# EAGLE design LVDT-Sensor NeuRev01 (EAGLE 5.12)
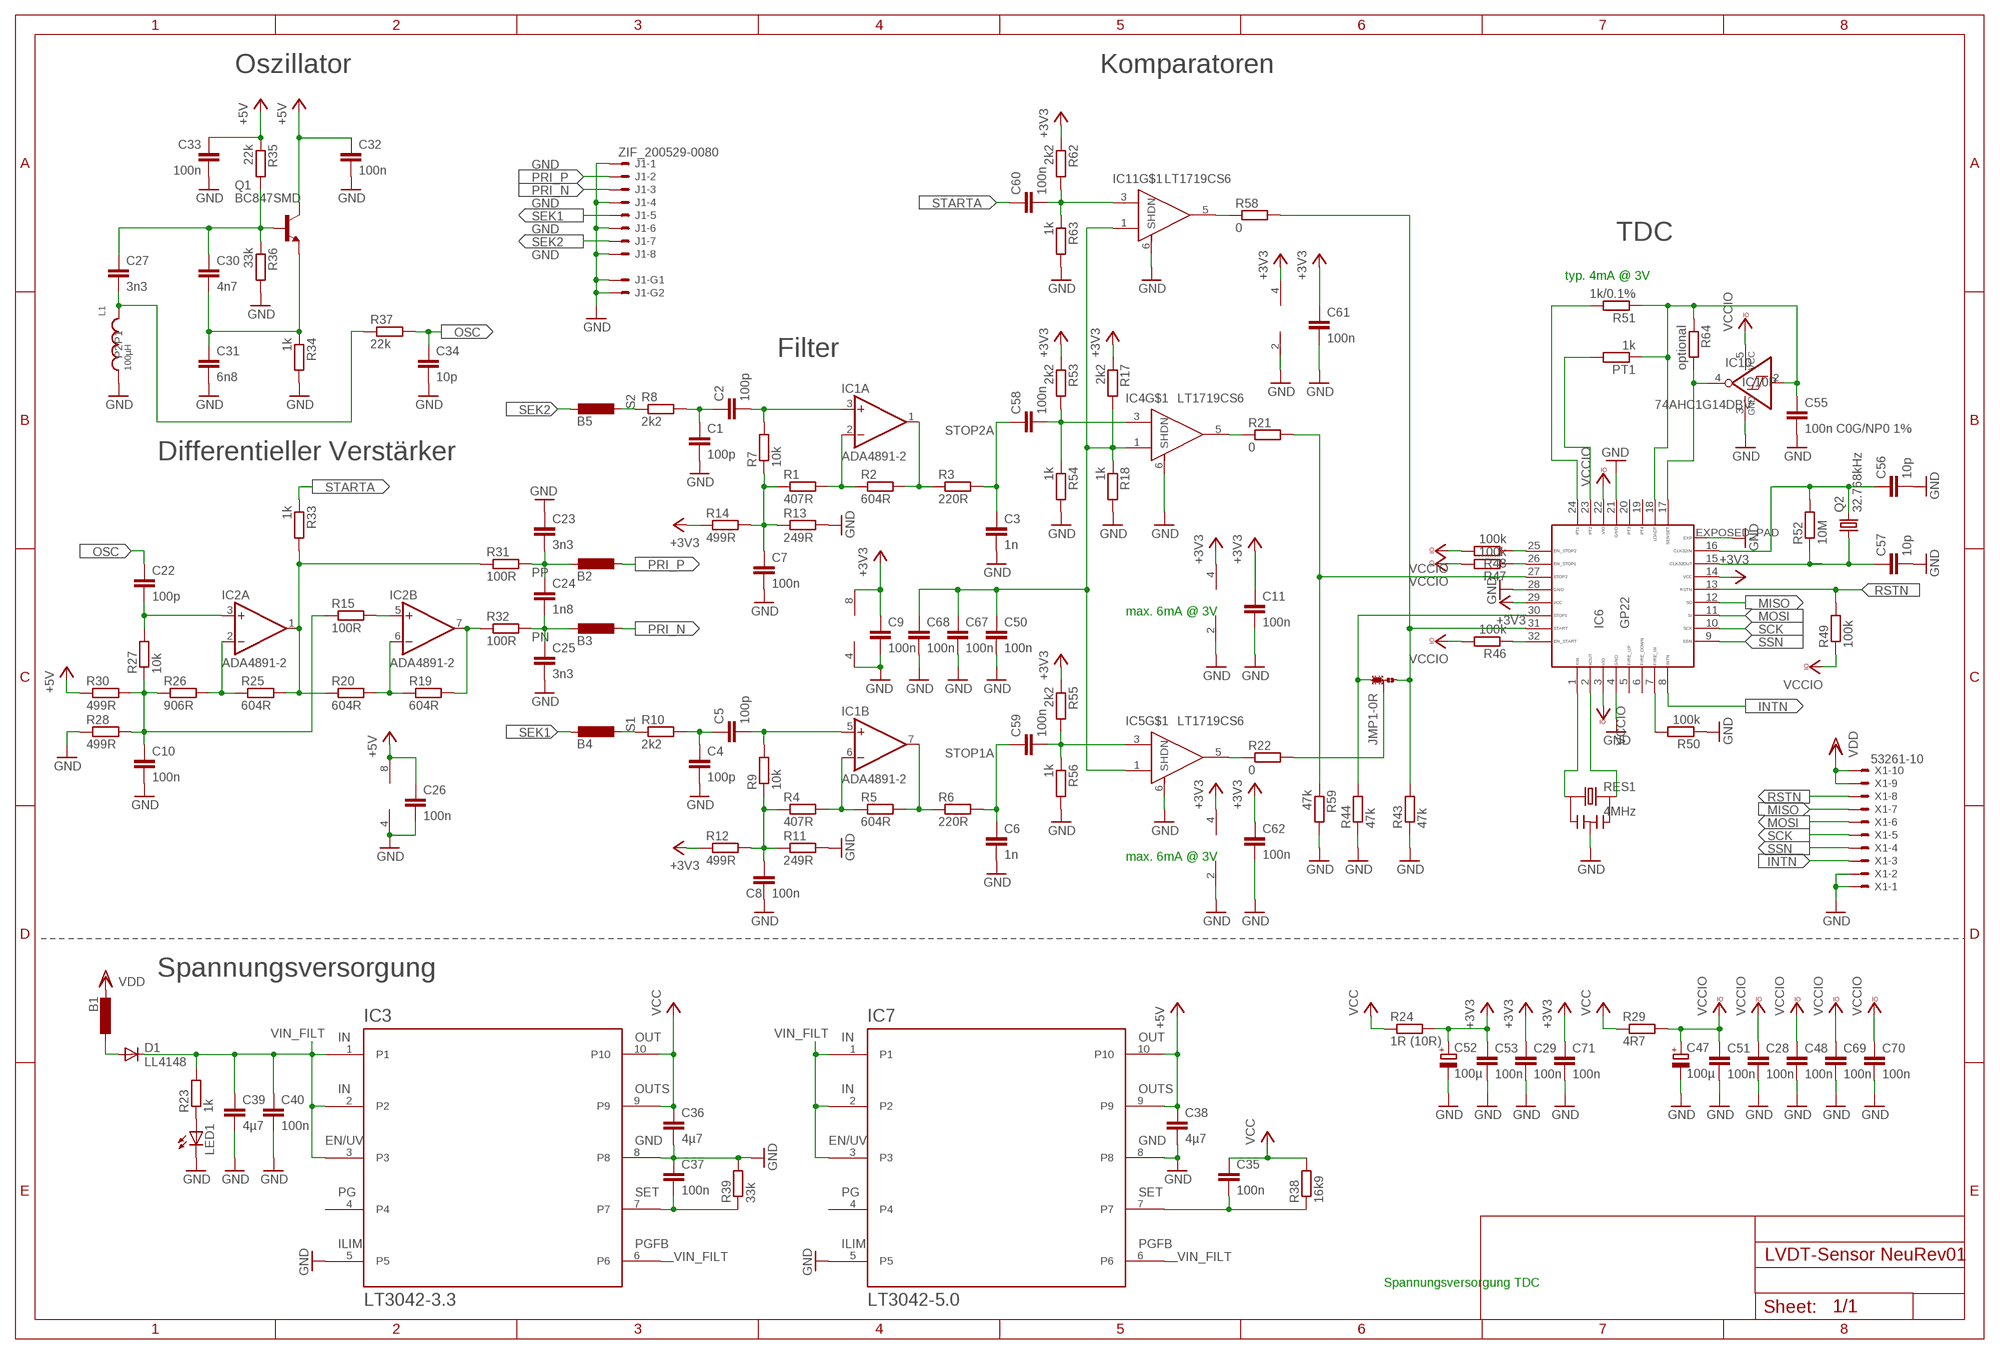
[diagram p0: schematic, sheet 1]

## Parts
B1  FERRITE-BEAD-SMD0805  [L0805]
B2  FERRITE-BEAD-SMD0805  [L0805]
B3  FERRITE-BEAD-SMD0805  [L0805]
B4  FERRITE-BEAD-SMD0805  [L0805]
B5  FERRITE-BEAD-SMD0805  [L0805]
C1  100p  C-EU0603-WAVE_SOLDERING  [0603-WAVE_SOLDERING]
C2  100p  C-EU0603-WAVE_SOLDERING  [0603-WAVE_SOLDERING]
C3  1n  C-EU0603-WAVE_SOLDERING  [0603-WAVE_SOLDERING]
C4  100p  C-EU0603-WAVE_SOLDERING  [0603-WAVE_SOLDERING]
C5  100p  C-EU0603-WAVE_SOLDERING  [0603-WAVE_SOLDERING]
C6  1n  C-EU0603-WAVE_SOLDERING  [0603-WAVE_SOLDERING]
C7  100n  C-EU0603-WAVE_SOLDERING  [0603-WAVE_SOLDERING]
C8  100n  C-EU0603-WAVE_SOLDERING  [0603-WAVE_SOLDERING]
C9  100n  C-EU0603-WAVE_SOLDERING  [0603-WAVE_SOLDERING]
C10  100n  C-EU0603-WAVE_SOLDERING  [0603-WAVE_SOLDERING]
C11  100n  C-EU0603-WAVE_SOLDERING  [0603-WAVE_SOLDERING]
C22  100p  C-EU0603-WAVE_SOLDERING  [0603-WAVE_SOLDERING]
C23  3n3  C-EU0603-WAVE_SOLDERING  [0603-WAVE_SOLDERING]
C24  1n8  C-EU0603-WAVE_SOLDERING  [0603-WAVE_SOLDERING]
C25  3n3  C-EU0603-WAVE_SOLDERING  [0603-WAVE_SOLDERING]
C26  100n  C-EU0603-WAVE_SOLDERING  [0603-WAVE_SOLDERING]
C27  3n3  C-EU0603-WAVE_SOLDERING  [0603-WAVE_SOLDERING]
C28  100n  C-EU0603-WAVE_SOLDERING  [0603-WAVE_SOLDERING]
C29  100n  C-EU0603-WAVE_SOLDERING  [0603-WAVE_SOLDERING]
C30  4n7  C-EU0603-WAVE_SOLDERING  [0603-WAVE_SOLDERING]
C31  6n8  C-EU0603-WAVE_SOLDERING  [0603-WAVE_SOLDERING]
C32  100n  C-EU0603-WAVE_SOLDERING  [0603-WAVE_SOLDERING]
C33  100n  C-EU0603-WAVE_SOLDERING  [0603-WAVE_SOLDERING]
C34  10p  C-EU0603-WAVE_SOLDERING  [0603-WAVE_SOLDERING]
C35  100n  C-EU0603-WAVE_SOLDERING  [0603-WAVE_SOLDERING]
C36  4µ7  C-EU1206-WAVE_SOLDERING  [1206-WAVE_SOLDERING]
C37  100n  C-EU0603-WAVE_SOLDERING  [0603-WAVE_SOLDERING]
C38  4µ7  C-EU1206-WAVE_SOLDERING  [1206-WAVE_SOLDERING]
C39  4µ7  C-EU1206-WAVE_SOLDERING  [1206-WAVE_SOLDERING]
C40  100n  C-EU0603-WAVE_SOLDERING  [0603-WAVE_SOLDERING]
C47  100µ  CPOL-EUSMCD  [SMC_D]
C48  100n  C-EU0603-WAVE_SOLDERING  [0603-WAVE_SOLDERING]
C50  100n  C-EU0603-WAVE_SOLDERING  [0603-WAVE_SOLDERING]
C51  100n  C-EU0603-WAVE_SOLDERING  [0603-WAVE_SOLDERING]
C52  100µ  CPOL-EUSMCD  [SMC_D]
C53  100n  C-EU0603-WAVE_SOLDERING  [0603-WAVE_SOLDERING]
C55  100n C0G/NP0 1%  C-EU1206-WAVE_SOLDERING  [1206-WAVE_SOLDERING]
C56  10p  C-EU0603-WAVE_SOLDERING  [0603-WAVE_SOLDERING]
C57  10p  C-EU0603-WAVE_SOLDERING  [0603-WAVE_SOLDERING]
C58  100n  C-EU0603-WAVE_SOLDERING  [0603-WAVE_SOLDERING]
C59  100n  C-EU0603-WAVE_SOLDERING  [0603-WAVE_SOLDERING]
C60  100n  C-EU0603-WAVE_SOLDERING  [0603-WAVE_SOLDERING]
C61  100n  C-EU0603-WAVE_SOLDERING  [0603-WAVE_SOLDERING]
C62  100n  C-EU0603-WAVE_SOLDERING  [0603-WAVE_SOLDERING]
C67  100n  C-EU0603-WAVE_SOLDERING  [0603-WAVE_SOLDERING]
C68  100n  C-EU0603-WAVE_SOLDERING  [0603-WAVE_SOLDERING]
C69  100n  C-EU0603-WAVE_SOLDERING  [0603-WAVE_SOLDERING]
C70  100n  C-EU0603-WAVE_SOLDERING  [0603-WAVE_SOLDERING]
C71  100n  C-EU0603-WAVE_SOLDERING  [0603-WAVE_SOLDERING]
D1  LL4148  DIODE-SOD80C  [SOD80C]
IC1  ADA4891-2  [MSOP8]
IC2  ADA4891-2  [MSOP8]
IC3  LT3042-3.3  REGLER_LT3042MSOP10_LT3042  [MSOP10]
IC4  LT1719CS6  [TSOT-23-6]
IC5  LT1719CS6  [TSOT-23-6]
IC6  GP22  [QFN32]
IC7  LT3042-5.0  REGLER_LT3042MSOP10_LT3042  [MSOP10]
IC10  74AHC1G14DBV  [SOT23-5]
IC11  LT1719CS6  [TSOT-23-6]
J1  ZIF_200529-0080  MOLEX_ZIF_8  [200529-0080]
JMP1  0R-JUMPA  [A0R-JMP]
L1  100µH  74408943101  [74408943101]
LED1  LEDCHIPLED_0603  [CHIPLED_0603]
PT1  1k  R-EU_0805-WAVE_SOLDERING  [0805-WAVE_SOLDERING]
Q1  BC847SMD  [SOT23]
Q2  32.768kHz  CRYSTALCC7V  [CC7V]
R1  407R  R-EU_0603-WAVE_SOLDERING  [0603-WAVE_SOLDERING]
R2  604R  R-EU_0603-WAVE_SOLDERING  [0603-WAVE_SOLDERING]
R3  220R  R-EU_0603-WAVE_SOLDERING  [0603-WAVE_SOLDERING]
R4  407R  R-EU_0603-WAVE_SOLDERING  [0603-WAVE_SOLDERING]
R5  604R  R-EU_0603-WAVE_SOLDERING  [0603-WAVE_SOLDERING]
R6  220R  R-EU_0603-WAVE_SOLDERING  [0603-WAVE_SOLDERING]
R7  10k  R-EU_0603-WAVE_SOLDERING  [0603-WAVE_SOLDERING]
R8  2k2  R-EU_0603-WAVE_SOLDERING  [0603-WAVE_SOLDERING]
R9  10k  R-EU_0603-WAVE_SOLDERING  [0603-WAVE_SOLDERING]
R10  2k2  R-EU_0603-WAVE_SOLDERING  [0603-WAVE_SOLDERING]
R11  249R  R-EU_0603-WAVE_SOLDERING  [0603-WAVE_SOLDERING]
R12  499R  R-EU_0603-WAVE_SOLDERING  [0603-WAVE_SOLDERING]
R13  249R  R-EU_0603-WAVE_SOLDERING  [0603-WAVE_SOLDERING]
R14  499R  R-EU_0603-WAVE_SOLDERING  [0603-WAVE_SOLDERING]
R15  100R  R-EU_0603-WAVE_SOLDERING  [0603-WAVE_SOLDERING]
R17  2k2  R-EU_0603-WAVE_SOLDERING  [0603-WAVE_SOLDERING]
R18  1k  R-EU_0603-WAVE_SOLDERING  [0603-WAVE_SOLDERING]
R19  604R  R-EU_0603-WAVE_SOLDERING  [0603-WAVE_SOLDERING]
R20  604R  R-EU_0603-WAVE_SOLDERING  [0603-WAVE_SOLDERING]
R21  0  R-EU_0603-WAVE_SOLDERING  [0603-WAVE_SOLDERING]
R22  0  R-EU_0603-WAVE_SOLDERING  [0603-WAVE_SOLDERING]
R23  1k  R-EU_0603-WAVE_SOLDERING  [0603-WAVE_SOLDERING]
R24  1R (10R)  R-EU_0805-WAVE_SOLDERING  [0805-WAVE_SOLDERING]
R25  604R  R-EU_0603-WAVE_SOLDERING  [0603-WAVE_SOLDERING]
R26  906R  R-EU_0603-WAVE_SOLDERING  [0603-WAVE_SOLDERING]
R27  10k  R-EU_0603-WAVE_SOLDERING  [0603-WAVE_SOLDERING]
R28  499R  R-EU_0603-WAVE_SOLDERING  [0603-WAVE_SOLDERING]
R29  4R7  R-EU_0805-WAVE_SOLDERING  [0805-WAVE_SOLDERING]
R30  499R  R-EU_0603-WAVE_SOLDERING  [0603-WAVE_SOLDERING]
R31  100R  R-EU_0603-WAVE_SOLDERING  [0603-WAVE_SOLDERING]
R32  100R  R-EU_0603-WAVE_SOLDERING  [0603-WAVE_SOLDERING]
R33  1k  R-EU_0603-WAVE_SOLDERING  [0603-WAVE_SOLDERING]
R34  1k  R-EU_0603-WAVE_SOLDERING  [0603-WAVE_SOLDERING]
R35  22k  R-EU_0603-WAVE_SOLDERING  [0603-WAVE_SOLDERING]
R36  33k  R-EU_0603-WAVE_SOLDERING  [0603-WAVE_SOLDERING]
R37  22k  R-EU_0603-WAVE_SOLDERING  [0603-WAVE_SOLDERING]
R38  16k9  R-EU_0603-WAVE_SOLDERING  [0603-WAVE_SOLDERING]
R39  33k  R-EU_0603-WAVE_SOLDERING  [0603-WAVE_SOLDERING]
R43  47k  R-EU_0603-WAVE_SOLDERING  [0603-WAVE_SOLDERING]
R44  47k  R-EU_0603-WAVE_SOLDERING  [0603-WAVE_SOLDERING]
R46  100k  R-EU_0603-WAVE_SOLDERING  [0603-WAVE_SOLDERING]
R47  100k  R-EU_0603-WAVE_SOLDERING  [0603-WAVE_SOLDERING]
R48  100k  R-EU_0603-WAVE_SOLDERING  [0603-WAVE_SOLDERING]
R49  100k  R-EU_0603-WAVE_SOLDERING  [0603-WAVE_SOLDERING]
R50  100k  R-EU_0603-WAVE_SOLDERING  [0603-WAVE_SOLDERING]
R51  1k/0.1%  R-EU_0805-WAVE_SOLDERING  [0805-WAVE_SOLDERING]
R52  10M  R-EU_0603-WAVE_SOLDERING  [0603-WAVE_SOLDERING]
R53  2k2  R-EU_0603-WAVE_SOLDERING  [0603-WAVE_SOLDERING]
R54  1k  R-EU_0603-WAVE_SOLDERING  [0603-WAVE_SOLDERING]
R55  2k2  R-EU_0603-WAVE_SOLDERING  [0603-WAVE_SOLDERING]
R56  1k  R-EU_0603-WAVE_SOLDERING  [0603-WAVE_SOLDERING]
R58  0  R-EU_0603-WAVE_SOLDERING  [0603-WAVE_SOLDERING]
R59  47k  R-EU_0603-WAVE_SOLDERING  [0603-WAVE_SOLDERING]
R62  2k2  R-EU_0603-WAVE_SOLDERING  [0603-WAVE_SOLDERING]
R63  1k  R-EU_0603-WAVE_SOLDERING  [0603-WAVE_SOLDERING]
R64  optional  R-EU_0603-WAVE_SOLDERING  [0603-WAVE_SOLDERING]
RES1  4MHz  CSTCRG53-R0  [CSTCR]
X1  53261-10  [53261-10]

## Nets
+3V3: C9.1 C11.1 C29.1 C52.+ C53.1 C61.1 C62.1 C71.1 IC1.8(V+) IC4.4(VCC) IC5.4(VCC) IC6.14(VCC) IC6.29(VCC) IC11.4(VCC) R12.1 R14.1 R17.1 R24.2 R53.1 R55.1 R62.1
+5V: C26.1 C32.1 C33.1 C38.1 IC2.8(V+) IC7.9 IC7.10 Q1.3(C) R30.1 R35.1
GND: C1.2 C3.2 C4.2 C6.2 C7.2 C8.2 C9.2 C10.2 C11.2 C23.1 C25.2 C26.2 C28.2 C29.2 C31.2 C32.2 C33.2 C34.2 C36.2 C37.1 C38.2 C39.2 C40.2 C47.- C48.2 C50.2 C51.2 C52.- C53.2 C55.2 C56.2 C57.2 C61.2 C62.2 C67.2 C68.2 C69.2 C70.2 C71.2 IC1.4(V-) IC2.4(V-) IC3.5 IC3.8 IC4.2(VDD) IC4.6(SHDN) IC5.2(VDD) IC5.6(SHDN) IC6.4(GND) IC6.21(GND) IC6.28(GND) IC6.EXPOSED_PAD(EXP) IC7.5 IC7.8 IC10.3(GND) IC11.2(VDD) IC11.6(SHDN) J1.1 J1.4 J1.6 J1.8 J1.G1 J1.G2 L1.P2 LED1.C R11.2 R13.2 R18.2 R28.1 R34.2 R36.2 R39.2 R43.1 R44.1 R50.1 R54.2 R56.2 R59.2 R63.2 RES1.2 X1.1 X1.2
INTN: IC6.8(INTN) X1.3
MISO: IC6.12(SO) X1.7
MOSI: IC6.11(SI) X1.6
N$1: IC1.7(B:OUT) R5.2 R6.1
N$2: JMP1.2 R22.2
N$3: IC1.6(B:-IN) R4.2 R5.1
N$4: IC1.2(A:-IN) R1.2 R2.1
N$5: IC1.1(A:OUT) R2.2 R3.1
N$6: C5.2 IC1.5(B:+IN) R9.2
N$7: LED1.A R23.1
N$8: B1.1 D1.A
N$9: C50.1 C67.1 C68.1 IC4.1(-IN) IC5.1(-IN) IC11.1(-IN) R17.2 R18.1
N$10: IC2.5(B:+IN) R15.2
N$11: C8.1 R4.1 R9.1 R11.1 R12.2
N$12: C7.1 R1.1 R7.1 R13.1 R14.2
N$13: C2.2 IC1.3(A:+IN) R7.2
N$14: C4.1 C5.1 R10.2
N$15: C1.1 C2.1 R8.2
N$16: IC2.1(A:OUT) R20.1 R25.2 R31.1 R33.2
N$17: C10.1 R15.1 R26.1 R27.1 R28.2 R30.2
N$18: IC2.6(B:-IN) R19.1 R20.2
N$20: IC2.7(B:OUT) R19.2 R32.1
N$21: IC2.2(A:-IN) R25.1 R26.2
N$23: IC5.5(OUT) R22.1
N$24: IC4.5(OUT) R21.1
N$25: C27.2 L1.P1 R37.1
N$27: IC6.32(EN_START) R46.1
N$28: C37.2 IC3.7 R39.1
N$29: C30.2 C31.1 Q1.2(E) R34.1
N$30: IC6.2(XOUT) RES1.3
N$31: IC6.1(XIN) RES1.1
N$32: C22.2 IC2.3(A:+IN) R27.2
N$33: IC6.26(EN_STOP1) R47.1
N$34: IC6.25(EN_STOP2) R48.1
N$35: IC6.7(FIRE_IN) R50.2
N$36: C55.1 IC6.18(LOADT) IC10.2(I) PT1.1 R51.1 R64.1
N$38: C35.2 IC7.7 R38.1
N$39: IC6.23(PT2) PT1.2
N$40: C27.1 C30.1 Q1.1(B) R35.2 R36.1
N$49: IC6.24(PT1) R51.2
N$56: IC11.5(OUT) R58.1
N$57: C56.1 IC6.16(CLK32IN) Q2.2 R52.2
N$60: C57.1 IC6.15(CLK32OUT) Q2.1 R52.1
N$61: C58.2 IC4.3(+IN) R53.2 R54.1
N$62: C59.2 IC5.3(+IN) R55.2 R56.1
N$63: C60.2 IC11.3(+IN) R62.2 R63.1
N$64: IC6.17(SENSET) IC10.4(O) R64.2
OSC: C22.1 C34.1 R37.2
PN: B3.2 C24.2 C25.1 R32.2
PP: B2.2 C23.2 C24.1 R31.2
PRI_N: B3.1 J1.3
PRI_P: B2.1 J1.2
RSTN: IC6.13(RSTN) R49.2 X1.8
S1: B4.1 R10.1
S2: B5.1 R8.1
SCK: IC6.10(SCK) X1.5
SEK1: B4.2 J1.5
SEK2: B5.2 J1.7
SSN: IC6.9(SSN) X1.4
START: IC6.31(START) JMP1.3 R43.2 R58.2
STARTA: C60.1 R33.1
STOP1: IC6.30(STOP1) JMP1.1 R44.2
STOP1A: C6.1 C59.1 R6.2
STOP2: IC6.27(STOP2) R21.2 R59.1
STOP2A: C3.1 C58.1 R3.2
VCC: C35.1 C36.1 IC3.9 IC3.10 R24.1 R29.1 R38.2
VCCIO: C28.1 C47.+ C48.1 C51.1 C69.1 C70.1 IC6.3(VIO) IC6.22(VIO) IC10.5(VCC) R29.2 R46.2 R47.2 R48.2 R49.1
VDD: B1.2 X1.9 X1.10
VIN_FILT: C39.1 C40.1 D1.C IC3.1 IC3.2 IC3.3 IC3.6 IC7.1 IC7.2 IC7.3 IC7.6 R23.2
Unconnected: IC3.4 IC6.5(FIRE_UP) IC6.6(FIRE_DOWN) IC6.19(PT4) IC6.20(PT3) IC7.4

## Notes on the sheet
- Oszillator | Komparatoren
- TDC
- typ. 4mA @ 3V
- Filter
- Differentieller Verstärker
- max. 6mA @ 3V
- max. 6mA @ 3V
- Spannungsversorgung
- Spannungsversorgung TDC

## Library data of the parts
B1-B5 = rcl:FERRITE-BEAD-SMD
C1-C11 C22-C40 C48 C50 C51 C53 C55-C62 C67-C71 = rcl:C-EU: CAPACITOR, European symbol
C47 C52 = rcl:CPOL-EU: POLARIZED CAPACITOR, European symbol
D1 = diode:DIODE-: DIODE
IC1 IC2 = LM7332:ADA4891-2
IC3 IC7 = Regler_LT3042:REGLER_LT3042
IC4 IC5 IC11 = linear-technology:LT1719: 4.5ns, Single/Dual Supply 3V/5V Comparators with Rail-to-Rail Outputs Linear Technology
IC6 = ACAM:GP22: Universal 2-Channel Time-to-Digital Converter
IC10 = 74xx-little-de:74*1G14: Single Schmitt-Trigger Inverter Gate
J1 = CON_FFC_FPC:MOLEX_ZIF_8: FFC-FPC ZIF Connector Bottom Contacts 8 Positions 1mm Pitch For FFC with thickness 0.3mm +- 0.05
JMP1 = jump-0r-smd:0R-JUMP: SMD 0R 0805 Jumper
L1 = WE-SPS SMD Schielded Power Inductor:74408943101: WE-SPS SMD Schielded Power Inductor
LED1 = led:LED: LED OSRAM: - CHIPLED LG R971, LG N971, LY N971, LG Q971, LY Q971, LO R971, LY R971 LH N974, LH R974 LS Q976, LO Q976, LY Q976 LO Q996 - Hyper CHIPLED LW Q18S LB Q993, LB Q99A, LB R99A - SideLED LS A670, LO A670, LY A670, LG A670, LP A670 LB A673, LV A673, LT A673, LW A673 LH A674 LY A675 LS A676, LA A676, LO A676, LY A676, LW A676 LS A679, LY A679, LG A679 - Hyper Micro SIDELED® LS Y876, LA Y876, LO Y876, LY Y876 LT Y87S - SmartLED LW L88C, LW L88S LB L89C, LB L89S, LG L890 LS L89K, LO L89K, LY L89K LS L896, LA L896, LO L896, LY L896 - TOPLED LS T670, LO T670, LY T670, LG T670, LP T670 LSG T670, LSP T670, LSY T670, LOP T670, LYG T670 LG T671, LOG T671, LSG T671 LB T673, LV T673, LT T673, LW T673 LH T674 LS T676, LA T676, LO T676, LY T676, LB T676, LH T676, LSB T676, LW T676 LB T67C, LV T67C, LT T67C, LS T67K, LO T67K, LY T67K, LW E67C LS E67B, LA E67B, LO E67B, LY E67B, LB E67C, LV E67C, LT E67C LW T67C LS T679, LY T679, LG T679 LS T770, LO T770, LY T770, LG T770, LP T770 LB T773, LV T773, LT T773, LW T773 LH T774 LS E675, LA E675, LY E675, LS T675 LS T776, LA T776, LO T776, LY T776, LB T776 LHGB T686 LT T68C, LB T68C - Hyper Mini TOPLED® LB M676 - Mini TOPLED Santana® LG M470 LS M47K, LO M47K, LY M47K Source: http://www.osram.convergy.de LUXEON: - LUMILED® LXK2-PW12-R00, LXK2-PW12-S00, LXK2-PW14-U00, LXK2-PW14-V00 LXK2-PM12-R00, LXK2-PM12-S00, LXK2-PM14-U00 LXK2-PE12-Q00, LXK2-PE12-R00, LXK2-PE12-S00, LXK2-PE14-T00, LXK2-PE14-U00 LXK2-PB12-K00, LXK2-PB12-L00, LXK2-PB12-M00, LXK2-PB14-N00, LXK2-PB14-P00, LXK2-PB14-Q00 LXK2-PR12-L00, LXK2-PR12-M00, LXK2-PR14-Q00, LXK2-PR14-R00 LXK2-PD12-Q00, LXK2-PD12-R00, LXK2-PD12-S00 LXK2-PH12-R00, LXK2-PH12-S00 LXK2-PL12-P00, LXK2-PL12-Q00, LXK2-PL12-R00 Source: www.luxeon.com KINGBRIGHT: KA-3528ASYC Source: www.kingbright.com
PT1 R1-R15 R17-R39 R43 R44 R46-R56 R58 R59 R62-R64 = rcl:R-EU_: RESISTOR, European symbol
Q1 = transistor-npn:BC847*: NPN Transistor
Q2 = crystal:CRYSTAL: CRYSTAL
RES1 = CeramicResonator:CSTCR: Murata CERALOCK
X1 = con-molex:53?-10: CONNECTOR wire to board 1.25 mm (.049 inch) pitch header; OC_FARNELL: unknown; OC_NEWARK: unknown

## Board
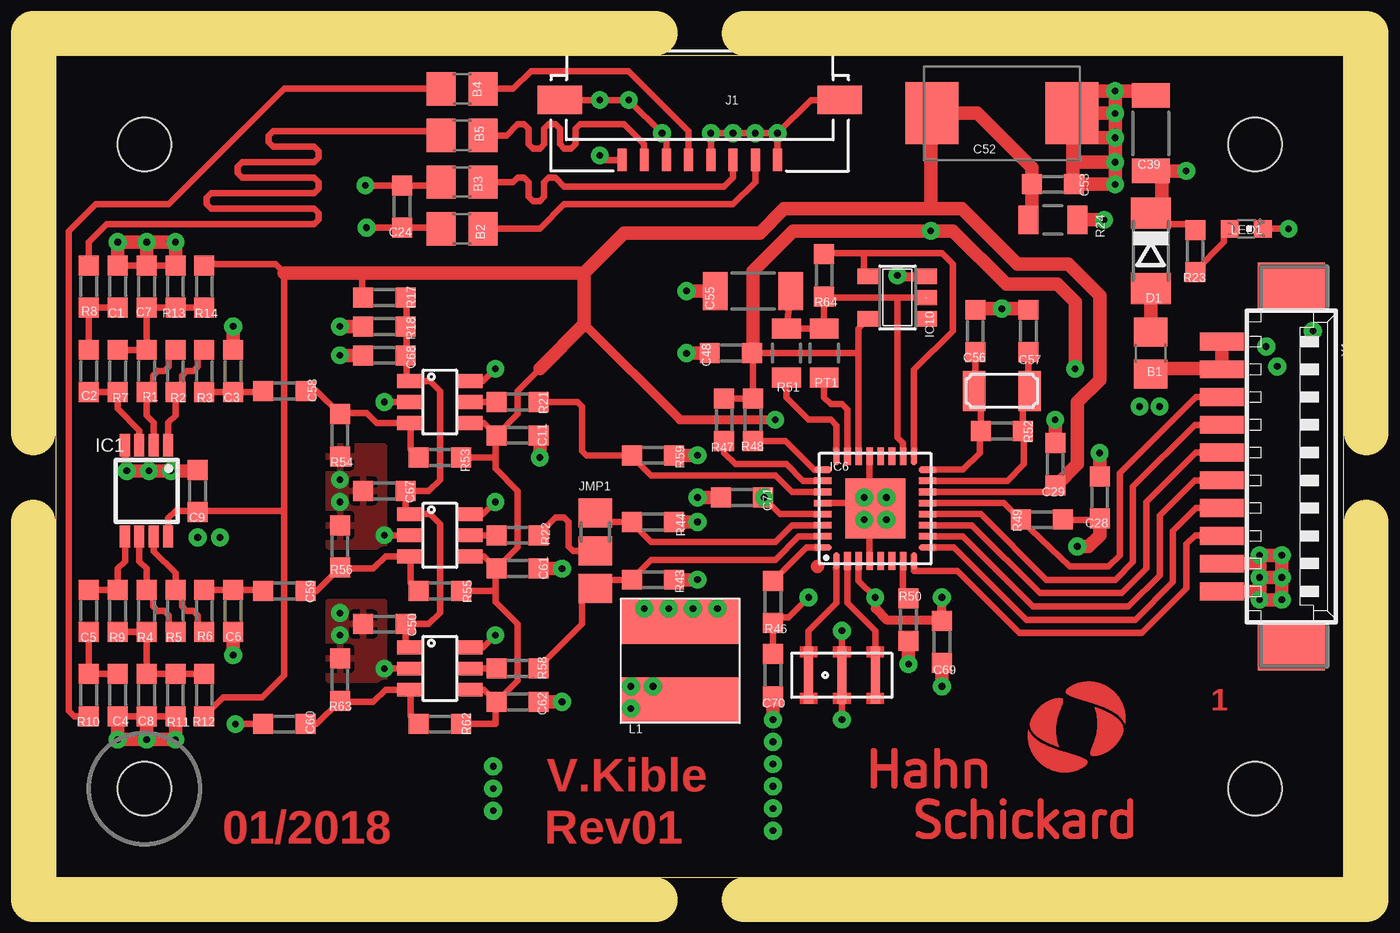
[diagram p1: board, top side]
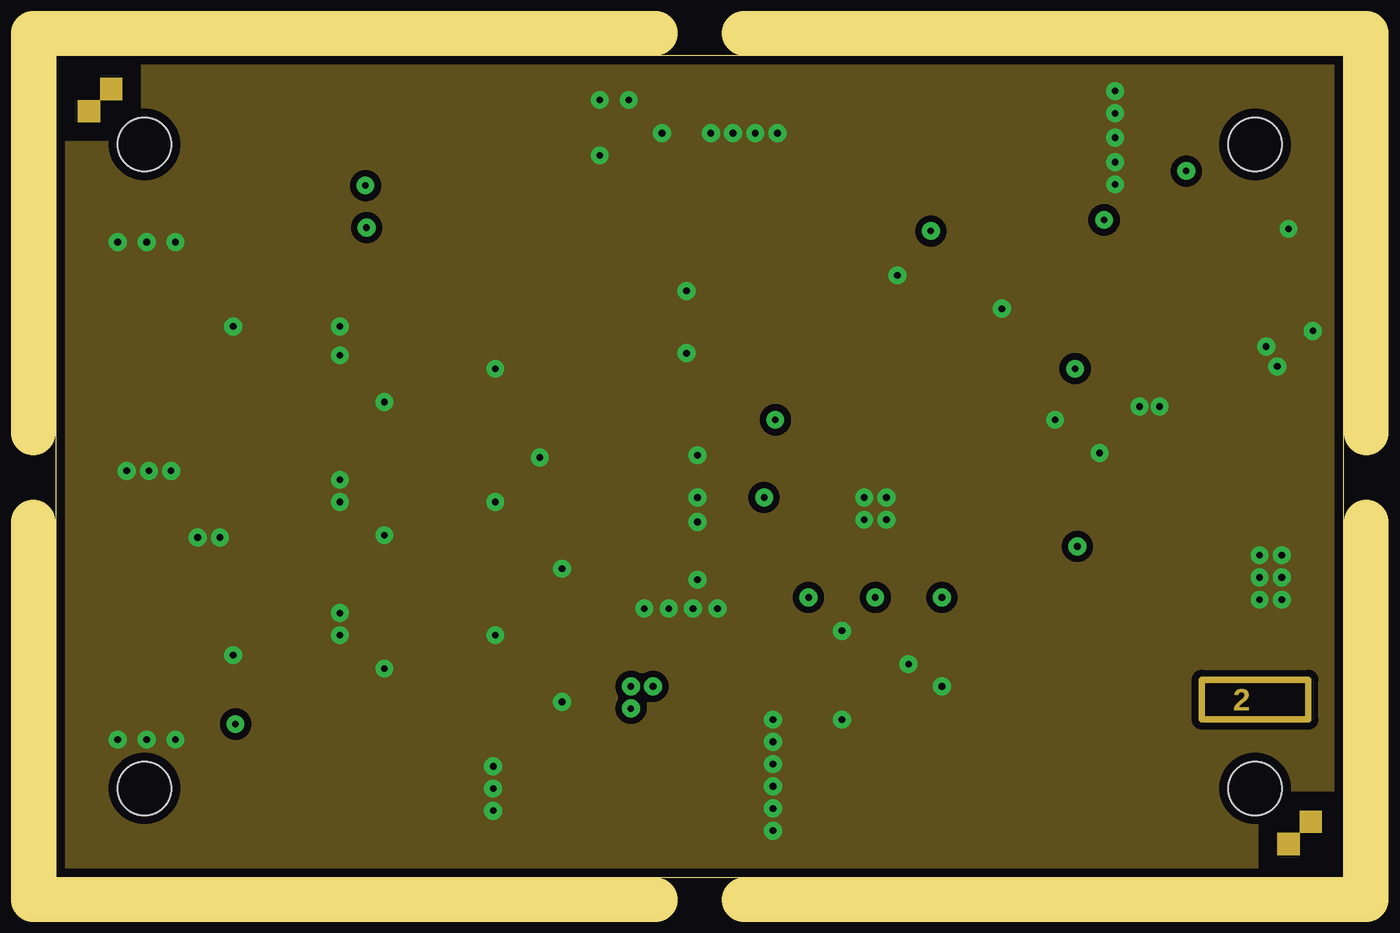
[diagram p2: board, inner layer Route2]
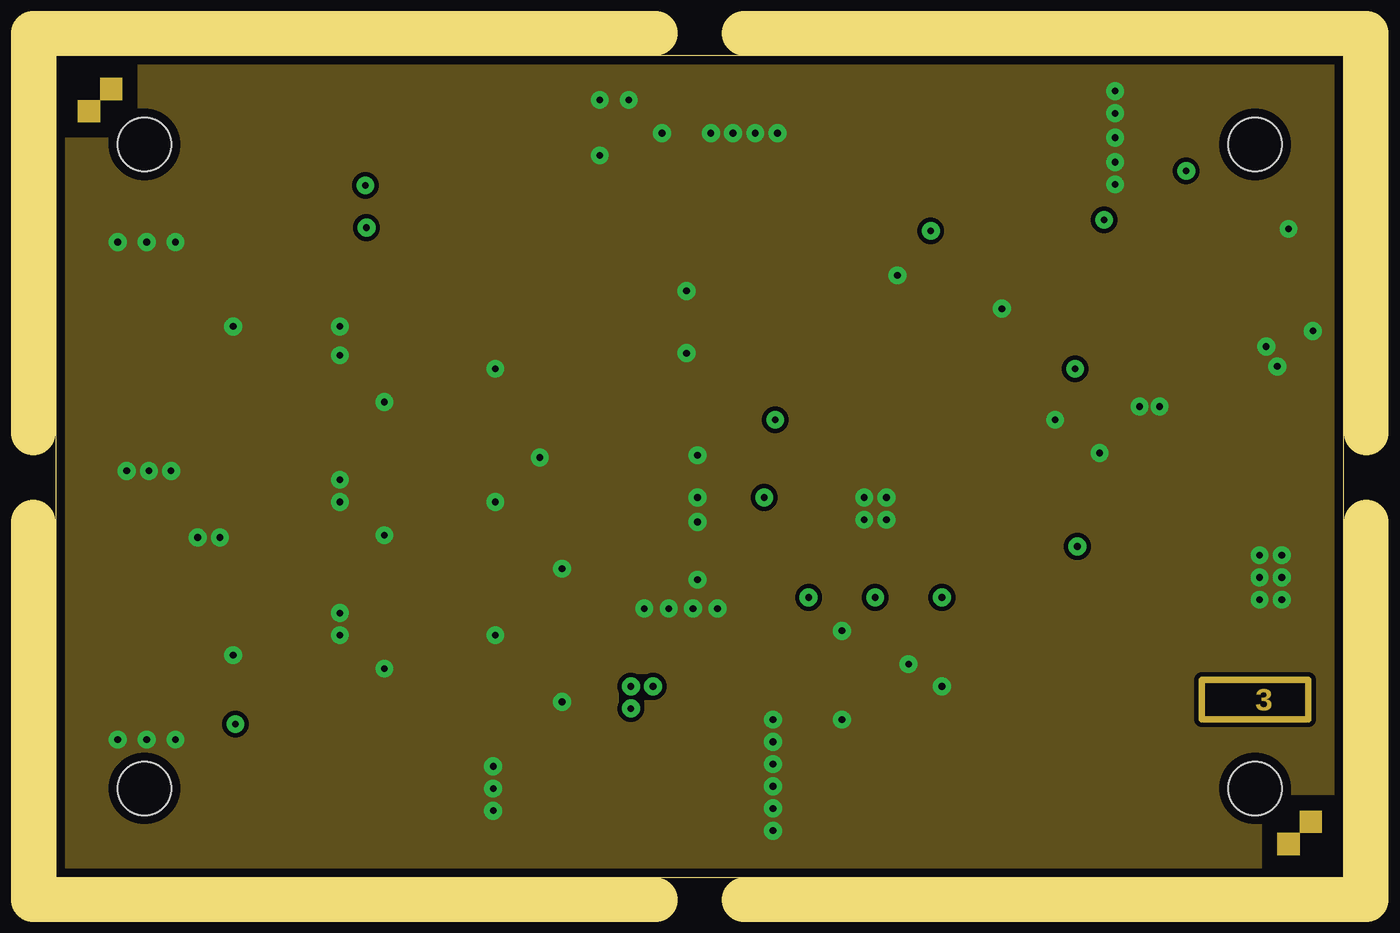
[diagram p3: board, inner layer Route15]
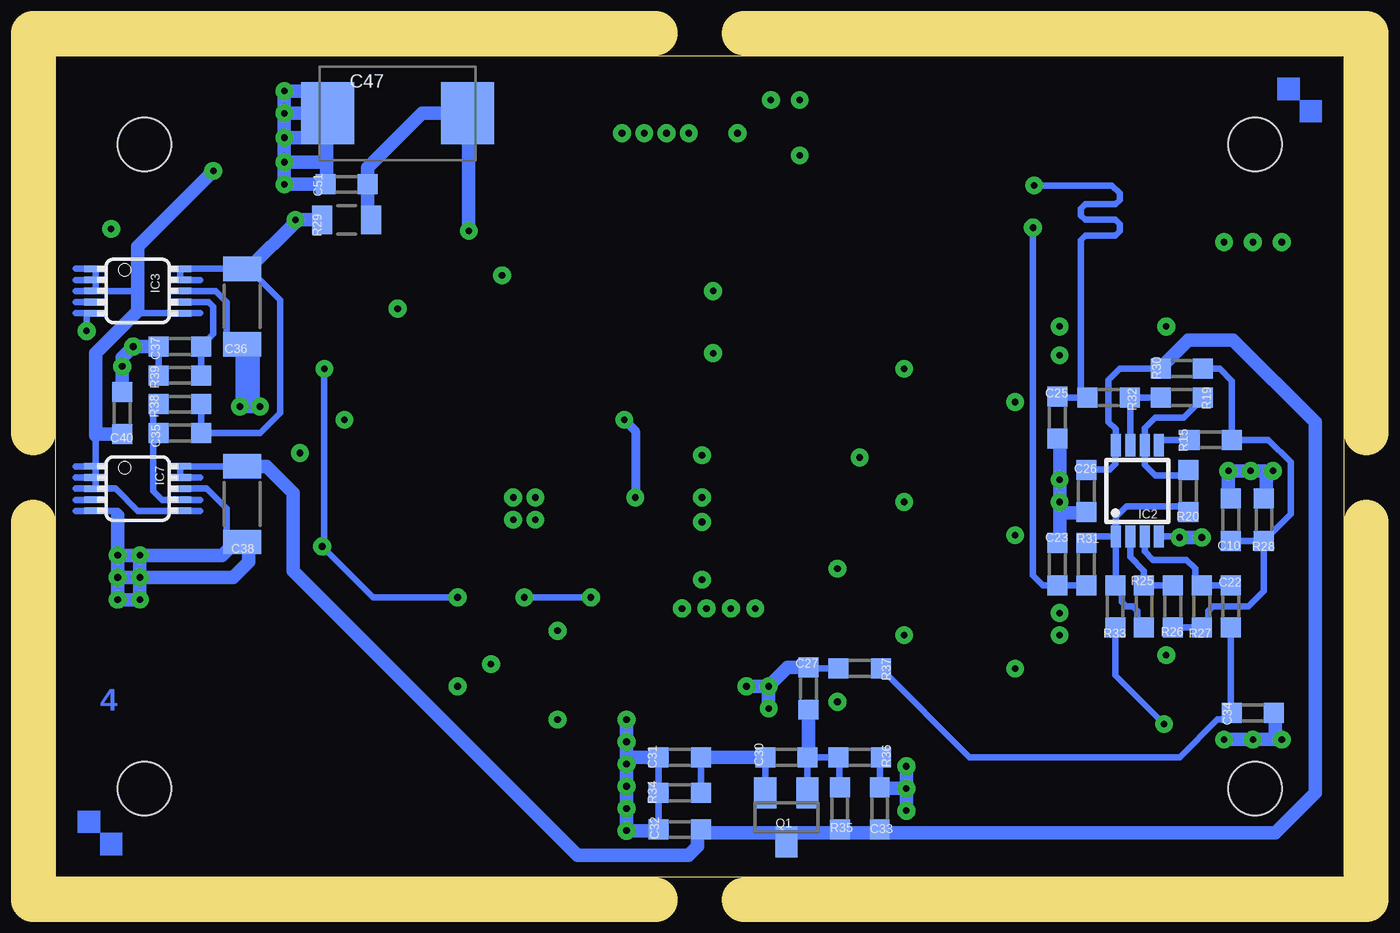
[diagram p4: board, bottom side, seen from below]

Size 58 x 37 mm. Coordinates in mm from the lower left corner, seen from the top.
Outline: 58,37 0,37 0,0 58,0 58,37
Copper layers (1*2+15*16): Top 0.035mm / dielectric 0.6mm / Route2 0.035mm / dielectric 0.2mm / Route15 0.035mm / dielectric 0.6mm / Bottom 0.035mm
Design rules "pcb-devboards Standard *": minimum track width 0.2mm, minimum drill 0.3mm, track to track 0.2mm, track to pad 0.2mm, pad to pad 0.2mm, via to via 0.2mm, smd to smd 0.2mm, copper to edge 0.4mm, drill to drill 0.2mm, minimum pad ring 0.25mm, minimum via ring 0.25mm, stop-mask expansion 0.1mm, vias tented up to drill 0.8mm, thermal gap 0.2mm
Holes 2.4 mm at 54,4 54,33 4,33 4,4
tRestrict: area 51.5,30.5 to 56.5,35.5; area 1.5,30.5 to 6.5,35.5; area 51.5,1.5 to 56.5,6.5
bRestrict: area 1.5,30.5 to 6.5,35.5; area 51.5,30.5 to 56.5,35.5; area 51.5,1.5 to 56.5,6.5
Milling: 8 lines

### Footprints (pad centres in the part's own frame; a part is rotated, then mirrored left to right if it is on the bottom)
L0805 = smd 1.3 x 1.5: 1 -0.95,0; 2 0.95,0
0603-WAVE_SOLDERING = smd 0.9 x 0.9: 1 -0.95,0; 2 0.95,0
1206-WAVE_SOLDERING = smd 1.1 x 1.7: 1 -1.7,0; 2 1.7,0
SMC_D = smd 2.4 x 2.8: + -3.15,0; - 3.15,0
SOD80C = smd 1.4 x 1.8: A 1.7,0; C -1.7,0
MSOP8 = smd 0.45 x 1: 1 -0.975,-2.05; 2 -0.325,-2.05; 3 0.325,-2.05; 4 0.975,-2.05; 5 0.975,2.05; 6 0.325,2.05; 7 -0.325,2.05; 8 -0.975,2.05
MSOP10 = smd 0.3 x 1.02: 1 -1,-1.9; 2 -0.5,-1.9; 3 0,-1.9; 4 0.5,-1.9; 5 1,-1.9; 6 1,1.9; 7 0.5,1.9; 8 0,1.9; 9 -0.5,1.9; 10 -1,1.9
TSOT-23-6 = smd 0.62 x 1.22: 1 -0.95,-1.31; 2 0,-1.31; 3 0.95,-1.31; 4 0.95,1.31; 5 0,1.31; 6 -0.95,1.31
QFN32 = smd 0.3 x 0.8: 1 -1.75,-2.36; 2 -1.25,-2.36; 3 -0.75,-2.36; 4 -0.25,-2.36; 5 0.25,-2.36; 6 0.75,-2.36; 7 1.25,-2.36; 8 1.75,-2.36; 17 1.75,2.36; 18 1.25,2.36; 19 0.75,2.36; 20 0.25,2.36; 21 -0.25,2.36; 22 -0.75,2.36; 23 -1.25,2.36; 24 -1.75,2.36 | smd 0.8 x 0.3: 9 2.36,-1.75; 10 2.36,-1.25; 11 2.36,-0.75; 12 2.36,-0.25; 13 2.36,0.25; 14 2.36,0.75; 15 2.36,1.25; 16 2.36,1.75; 25 -2.36,1.75; 26 -2.36,1.25; 27 -2.36,0.75; 28 -2.36,0.25; 29 -2.36,-0.25; 30 -2.36,-0.75; 31 -2.36,-1.25; 32 -2.36,-1.75 | smd 2.7 x 2.7: EXPOSED_PAD 0,0
SOT23-5 = smd 0.69 x 0.99: 1 -0.95,-1.29; 2 0,-1.29; 3 0.95,-1.29; 4 0.95,1.3; 5 -0.95,1.3
200529-0080 = smd 0.4 x 1: 1 -3.5,2.7; 2 -2.5,2.7; 3 -1.5,2.7; 4 -0.5,2.7; 5 0.5,2.7; 6 1.5,2.7; 7 2.5,2.7; 8 3.5,2.7 | smd 2 x 1.3: G1 -6.3,0; G2 6.3,0
A0R-JMP = smd 1.5 x 1.3: 1 0,1.7; 2 0,0; 3 0,-1.7
74408943101 = smd 5.3 x 2: P1 2.75,1.1; P2 2.75,4.6
CHIPLED_0603 = smd 0.8 x 0.8: A 0,-0.75; C 0,0.75
0805-WAVE_SOLDERING = smd 0.9 x 1.3: 1 -1.1,0; 2 1.1,0
SOT23 = smd 1 x 1.4: 1 -0.95,-1.1; 2 0.95,-1.1; 3 0,1.1
CC7V = smd 1 x 1.8: 1 -1.25,0; 2 1.25,0
CSTCR = smd 0.4 x 2.6: 1 -1.5,0; 2 0,0; 3 1.5,0
53261-10 = smd 0.8 x 2: 1 5.625,-2.5; 2 4.375,-2.5; 3 3.125,-2.5; 4 1.875,-2.5; 5 0.625,-2.5; 6 -0.625,-2.5; 7 -1.875,-2.5; 8 -3.125,-2.5; 9 -4.375,-2.5; 10 -5.625,-2.5 | smd 2.1 x 3: S1 8.125,0.625; S2 -8.125,0.625

### Placement (x,y rotation side)
B1  49.3,23.6 270 top
B2  18.3,29.2 180 top
B3  18.3,31.3 180 top
B4  18.3,35.5 0 top
B5  18.3,33.4 0 top
C1  2.8,26.6 90 top
C2  1.5,22.8 270 top
C3  8,22.8 90 top
C4  2.8,8.2 270 top
C5  1.5,12 90 top
C6  8,12 270 top
C7  4.1,26.6 90 top
C8  4.1,8.2 270 top
C9  6.4,17.4 90 top
C10  5.1,16.1 90 bottom
C11  20.8,19.9 0 top
C22  5.1,12.2 90 bottom
C23  12.9,14.1 270 bottom
C24  15.6,30.2 90 top
C25  12.9,20.7 270 bottom
C26  11.6,17.4 270 bottom
C27  24.1,8.5 90 bottom
C28  47,17.1 90 top
C29  45,18.6 90 top
C30  25.1,5.4 180 bottom
C31  29.9,5.4 180 bottom
C32  29.9,2.15 180 bottom
C33  20.9,3.1 90 bottom
C34  4.1,7.4 0 bottom
C35  52.4,20 180 bottom
C36  49.6,25.7 270 bottom
C37  52.4,23.9 0 bottom
C38  49.6,16.8 270 bottom
C39  49.3,33.5 90 top
C40  55,20.9 90 bottom
C47  42.6,34.4 180 bottom
C48  30.4,23.6 180 top
C50  14.8,11.4 180 top
C51  44.9,31.2 180 bottom
C52  42.6,34.4 0 top
C53  44.9,31.2 0 top
C55  31.4,26.4 180 top
C56  41.4,24.6 90 top
C57  43.8,24.6 90 top
C58  10.3,21.9 0 top
C59  10.3,12.9 0 top
C60  10.3,6.9 0 top
C61  20.8,13.9 0 top
C62  20.8,7.9 0 top
C67  14.8,17.4 180 top
C68  14.8,23.5 180 top
C69  39.9,10.6 270 top
C70  32.3,9.1 270 top
C71  30.9,17.1 180 top
D1  49.3,28.2 270 top
IC1  4.1,17.4 180 top
IC2  9.3,17.4 0 bottom
IC3  54.3,26.4 270 bottom
IC4  17.3,21.4 270 top
IC5  17.3,15.4 270 top
IC6  36.9,16.6 0 top
IC7  54.3,17.5 270 bottom
IC10  37.9,26.1 90 top
IC11  17.3,9.4 270 top
J1  29,35 180 top
JMP1  24.3,14.7 0 top
L1  25.4,6.9 0 top
LED1  53.6,29.2 270 top
PT1  34.6,23.6 270 top
Q1  25.1,2.7 180 bottom
Q2  42.6,21.9 180 top
R1  4.1,22.8 270 top
R2  5.4,22.8 270 top
R3  6.7,22.8 270 top
R4  4.1,12 90 top
R5  5.4,12 90 top
R6  6.7,12 90 top
R7  2.8,22.8 270 top
R8  1.5,26.6 270 top
R9  2.8,12 90 top
R10  1.5,8.2 90 top
R11  5.4,8.2 270 top
R12  6.7,8.2 90 top
R13  5.4,26.6 90 top
R14  6.7,26.6 270 top
R15  6,19.7 180 bottom
R17  14.8,26.1 0 top
R18  14.8,24.8 180 top
R19  7.3,21.6 180 bottom
R20  7,17.4 90 bottom
R21  20.8,21.4 0 top
R22  20.8,15.4 0 top
R23  51.3,28.2 90 top
R24  44.9,29.6 180 top
R25  9,12.2 270 bottom
R26  7.7,12.2 90 bottom
R27  6.4,12.2 90 bottom
R28  3.6,16.1 270 bottom
R29  44.9,29.6 0 bottom
R30  7.3,22.9 0 bottom
R31  11.6,14.1 270 bottom
R32  10.6,21.6 180 bottom
R33  10.3,12.2 90 bottom
R34  29.9,3.8 180 bottom
R35  22.7,3.1 90 bottom
R36  21.8,5.4 0 bottom
R37  21.8,9.4 0 bottom
R38  52.4,21.3 0 bottom
R39  52.4,22.6 180 bottom
R43  26.9,13.4 180 top
R44  26.9,16 180 top
R46  32.3,12.4 270 top
R47  30.1,20.6 90 top
R48  31.4,20.6 90 top
R49  44.4,16.1 180 top
R50  38.4,11.6 90 top
R51  32.9,23.6 270 top
R52  42.6,20.1 180 top
R53  17.3,18.9 180 top
R54  12.8,19.9 270 top
R55  17.3,12.9 180 top
R56  12.8,14.9 90 top
R58  20.8,9.4 0 top
R59  26.9,19 0 top
R62  17.3,6.9 180 top
R63  12.8,8.9 90 top
R64  34.6,27.1 90 top
RES1  35.4,9.1 0 top
U$1  [LOGO-12X8]  36.7,1.7 0 top
X1  55,18.5 270 top

### Tracks (layer width: path | path; a pad name or v marks a point on that pad's centre or on a via)
+3V3  (via drill 0.3)
  Top 0.3: 21.8,22.9 20.8,21.9 20.8,20.85 C11.1 | IC11.4 19.3,8.45 C62.1 | C62.1 20.8,8.85 20.8,11.4 19.8,12.4 19.8,12.9 | C61.1 19.3,14.45 IC5.4 18.3,14.45 | C61.1 20.8,14.85 20.8,17.4 19.8,18.4 19.8,18.9 | 19.8,12.9 19.8,13.9 C61.1 | IC4.4 19.3,20.45 C11.1 | 19.8,18.9 19.8,19.9 C11.1 | 19.8,12.9 R55.1 | 19.8,18.9 R53.1 | R62.1 19.8,6.9 19.8,7.85 C62.1 | IC6.14 44.7,17.35 C29.1 | IC6.29 32.6,16.35 C71.1 v31.9,17.1 | IC1.8 5.08,16.18 5.4,16.5 6.4,16.5 | R12.1 7.55,8.1 9.3,8.1 10.3,9.1 10.3,16.5 | 10.3,16.5 6.4,16.5 | 6.4,16.5 C9.1 | 10.3,16.5 10.3,27.2 9.9,27.6 6.7,27.6 R14.1 | R17.1 13.8,26.1 13.8,27.2
  Top 0.4: 23.8,24.9 28.1,20.6 28.6,20.6 v32.4,20.6
  Top 0.6: C29.1 45.05,17.65 46,18.6 46,21.4 47,22.4 47,26.2 45.6,27.6 43.3,27.6 40.8,30.1 39.4,30.1 | 21.8,22.9 23.8,24.9 23.8,27.2 | 10.3,27.2 13.8,27.2 23.8,27.2 | 23.8,27.2 25.6,29 31.7,29 32.8,30.1 39.4,30.1 | R24.2 43.95,29.6 C53.1 43.95,31.95 41.5,34.4 C52.+ 39.4,34.4 39.4,30.1
  Bottom 0.4: v31.9,17.1 31.9,20.1 v32.4,20.6
+5V
  Bottom 0.3: R30.1 10.1,22.9 10.6,22.4 10.6,20.5 10.28,20.18 IC2.8 10.3,19.45 10.3,18.6 10.55,18.35 C26.1 | 28.95,2 C32.1 | 25.1,2 Q1.3 | 20.9,2 C33.1 | 22.7,2.2 R35.1 22.7,2 | 51.5,18 IC7.9 IC7.10 C38.1
  Bottom 0.6: 28.95,2 25.1,2 22.7,2 20.9,2 3.1,2 1.3,3.8 1.3,20.5 5,24.2 7,24.2 8.2,23 8.2,22.9 R30.1 | C38.1 48.5,18.5 47.3,17.3 47.3,13.8 34.5,1 29.5,1 29.1,1.4 29.1,2 C32.1
GND  (via drill 0.3)
  Top 0.3: v35.4,11.1 RES1.2 v35.4,7.1 | IC5.6 19.25,16.35 v19.8,16.9 | IC4.6 19.25,22.35 v19.8,22.9 | IC11.6 19.25,10.35 v19.8,10.9 | v14.8,21.4 IC4.2 | v14.8,15.4 IC5.2 | v14.8,9.4 IC11.2 | IC6.4 36.65,16.1 v36.4,16.1 | IC6.21 36.65,17.1 v37.4,17.1 | IC6.28 36.4,16.85 v36.4,17.1 | IC6.EXPOSED_PAD 36.9,16.1 v37.4,16.1 | IC1.4 3.12,18.38 v3.2,18.3 | 6.4,18.3 C9.2 | R13.2 C7.2 C1.2 | C4.2 C8.2 R11.2 | J1.G2 v24.5,35 v25.8,35 v27.3,33.5 27.5,33.3 J1.6 | J1.8 24.5,32.3 v24.5,32.5 | J1.4 v29.5,33.5 v30.5,33.5 v31.5,33.5 v32.5,33.5 | v32.5,33.5 J1.1 | v32.5,33.5 34,35 J1.G1 | LED1.C v55.5,29.2
  Top 0.4: IC10.3 37.95,27.05 v37.9,27.1
  Top 0.6: C56.2 41.4,25.6 v42.6,25.6 43.8,25.6 C57.2 | C62.2 v22.8,7.9 | R18.2 v12.8,24.8 | C61.2 v22.8,13.9 | R59.2 v28.9,19 | C55.2 v28.4,26.4 | v38.4,9.6 R50.1 | R43.1 v28.9,13.4 | R44.1 v28.9,16 | C29.2 v45,20.6 | C28.2 v47,19.1 | C48.2 v28.4,23.6 | C68.2 v12.8,23.5 | v21.8,18.9 21.8,19.9 C11.2 | C69.2 v39.9,8.6 | v32.3,7.1 C70.2 | C71.2 v28.9,17.1 | v3.2,18.3 v4.2,18.3 v5.2,18.3 6.4,18.3 | C3.2 v8,24.8 | v8,10 C6.2 | v4.1,28.6 v2.8,28.6 C1.2 | v4.1,28.6 v5.4,28.6 5.4,27.6 | v4.1,28.6 4.1,27.6 | C4.2 v2.8,6.2 v4.1,6.2 | v4.1,6.2 v5.4,6.2 5.4,7.2 | v4.1,6.2 4.1,7.2 | X1.2 54.2,14.12 v54.2,13.5 | v54.2,13.5 v54.2,12.5 | v54.2,12.5 54.2,12.88 X1.1 | v54.2,13.5 v54.2,14.5 v55.2,14.5 v55.2,13.5 | v55.2,13.5 v55.2,12.5 v54.2,12.5 | v54.2,13.5 v55.2,13.5 | v47.7,33.3 v47.7,34.4 | v47.7,34.4 v47.7,35.4 | v47.7,35.4 49.3,35.4 C39.2 | v47.7,34.4 C52.- | v47.7,35.4 45.8,35.4 | v47.7,32.2 v47.7,33.3 | v47.7,32.2 v47.7,31.2 45.9,31.2 | v47.7,33.3 45.8,33.3 45.8,32.2 | 45.8,32.2 v47.7,32.2 | C53.2 45.8,31.2 45.8,32.2 | 28.15,12.1 L1.P2 | 28.15,12.1 v27.6,12.1 v26.5,12.1 | 28.15,12.1 v28.7,12.1 v29.8,12.1
  Bottom 0.3: 3.6,18.3 v3.2,18.3 | v7.4,15.3 7.4,15.35 IC2.4 | C31.2 R34.2 C32.2 | C33.2 20.9,5.4 R36.2 | 57.1,16.5 IC7.5 55.2,16.5 55.2,16.3 | IC7.8 51.2,17.5 50.3,16.6 50.3,15.1 C38.2 | C36.2 50.3,24 50.3,25.9 50.8,26.4 IC3.8 | 56.6,25.4 57.1,25.4 | C37.1 R39.2 | 56.6,25.4 IC3.5 | v56.6,24.6 56.6,25.4
  Bottom 0.6: v3.2,18.3 v5.2,18.3 5.2,17.05 C10.2 | R28.1 3.5,17.05 3.5,18.3 3.6,18.3 | C25.2 12.8,19.75 v12.8,17.9 v12.8,16.9 12.8,16.4 | 12.8,16.4 12.8,15.05 C23.1 | C26.2 11.6,16.4 12.8,16.4 | v7.4,15.3 v6.4,15.3 | 3.1,6.2 v2.8,6.2 | 3.1,6.2 v4.1,6.2 v5.4,6.2 | 3.1,6.2 3.1,7.4 C34.2 | 32.3,5.4 v32.3,5.1 v32.3,4.1 v32.3,3.1 v32.3,2.1 30.85,2.1 C32.2 | 32.3,5.4 v32.3,6.1 v32.3,7.1 | v19.7,4 v19.7,5 | v19.7,3 v19.7,4 | v19.7,4 20.9,4 C33.2 | 32.3,5.4 30.9,5.4 | 49.6,21.2 C36.2 | 49.6,21.2 v48.8,21.2 | 49.6,21.2 v49.7,21.2 49.1,21.2 49.1,23.9 | C38.2 49.9,15.1 50.5,14.5 v54.2,14.5 | v54.2,14.5 v55.2,14.5 | v55.2,14.5 v55.2,13.5 | v55.2,13.5 v55.2,12.5 v54.2,12.5 v54.2,13.5 | v54.2,14.5 v54.2,13.5 | v54.2,13.5 v55.2,13.5 | v54.2,13.5 50,13.5 49.3,14.2 49.3,15.1 | v55.2,14.5 55.2,16.3 | C37.1 v54.5,23.9 55,23.4 v55,23 C40.2 | v47.7,34.4 C52.- | v47.7,34.4 v47.7,35.4 46.2,35.4 | v47.7,33.3 v47.7,34.4 | v47.7,32.2 v47.7,33.3 | v47.7,32.2 v47.7,31.2 C53.2 45.8,31.2 45.8,32.2 | v47.7,33.3 46.1,33.3 | v47.7,32.2 45.8,32.2 | 45.8,32.2 45.8,33.3
  other vias: 12.8,10.9 12.8,11.9
  pour Route2 (isolate 0.3, rank 3): 58,37 4,37 4,33 0,33 0,0 54,0 54,4 58,4
  pour Top (isolate 0.3): 12.3,8.9 12.3,12.4 14.8,12.4 14.8,8.9
  pour Top (isolate 0.3): 12.3,14.9 12.3,19.4 14.8,19.4 14.8,14.9
  pour Route15: 0,33 4,33 4,37 58,37 58,4 54,4 54,0 0,0
INTN
  Top 0.3: IC6.8 38.65,13.8 40.6,13.8 43.4,11 48.9,11 50.9,13 50.9,15 51.3,15.4 52.5,15.4 X1.3
MISO
  Top 0.3: IC6.12 41.65,16.35 44.6,13.4 47.7,13.4 48.5,14.2 48.5,17.6 51.27,20.38 X1.7
MOSI
  Top 0.3: IC6.11 41.25,15.85 44.3,12.8 48,12.8 49.1,13.9 49.1,16.9 51.33,19.12 X1.6
N$1
  Top 0.3: IC1.7 4.42,14.68 5.4,13.7 R5.2 5.7,12.95 5.7,12.2 5.9,12 6.2,12 6.4,11.8 6.4,11.05 R6.1
N$2
  Top 0.3: R22.2 21.7,15.4 22.5,16.2 22.9,16.2 23.1,16 23.1,14.9 23.3,14.7 JMP1.2
N$3
  Top 0.3: IC1.6 3.77,14.22 4.1,13.9 R4.2 4.4,12.95 4.4,12.2 4.6,12 4.9,12 5.1,11.8 5.1,11.05 R5.1
N$4
  Top 0.3: IC1.2 4.42,20.48 4.1,20.8 R1.2 4.4,21.85 4.4,22.6 4.6,22.8 4.9,22.8 5.1,23 5.1,23.75 R2.1
N$5
  Top 0.3: IC1.1 5.08,20.48 5.4,20.8 R2.2 5.7,21.85 5.7,22.6 5.9,22.8 6.2,22.8 6.4,23 6.4,23.75 R3.1
N$6
  Top 0.3: IC1.5 3.12,14.22 2.8,13.9 R9.2 C5.2
N$7
  Top 0.3: LED1.A 52.6,29.1 52.6,28.6 51.3,27.3 R23.1
N$8
  Top 0.6: B1.1 D1.A
N$9
  Top 0.3: IC11.1 15.75,10.59 C50.1 16.8,11.4 17.3,11.9 17.3,15.9 16.85,16.35 IC5.1 15.75,16.59 C67.1 16.8,17.4 17.3,17.9 17.3,21.9 16.85,22.35 IC4.1 15.8,22.35 15.8,23.5 | 15.8,23.5 C68.1 | 15.8,23.5 15.8,24.8 | 15.8,24.8 R18.1 | 15.8,24.8 15.8,26.1 R17.2
N$10
  Bottom 0.3: R15.2 8.32,19.7 IC2.5
N$11
  Top 0.3: R9.1 R4.1 C8.1 R11.1 R12.2
N$12
  Top 0.3: R14.2 R13.1 C7.1 R1.1 R7.1
N$13
  Top 0.3: IC1.3 3.77,20.12 2.8,21.1 R7.2 C2.2
N$14
  Top 0.3: C5.1 R10.2 C4.1
N$15
  Top 0.3: C2.1 R8.2 C1.1
N$16
  Bottom 0.3: IC2.1 10.28,13.18 R33.2 10,13.15 10,12.4 9.8,12.2 9.5,12.2 9.3,12 9.3,11.25 R25.2 | R31.1 11.6,15.35 IC2.1 | IC2.1 10.28,16.23 9.8,16.7 7,16.7 R20.1
N$17
  Bottom 0.3: R30.2 5.6,22.9 5.05,22.35 R15.1 3.4,19.7 2.4,18.7 2.4,16.35 R28.2 | R26.1 R27.1 6.1,11.25 6.1,12 5.9,12.2 4.3,12.2 3.6,12.9 R28.2 | R28.2 C10.1
N$18
  Bottom 0.3: R19.1 6.35,21.55 7.2,20.7 8.5,20.7 8.97,20.23 IC2.6 8.97,18.57 8.5,18.1 7,18.1 R20.2
N$19
  Route2 0.3: 51.6,7.1 51.6,8.9 56.4,8.9 56.4,7.1 51.6,7.1
N$20
  Bottom 0.3: IC2.7 9.62,21.6 R32.1 R19.2
N$21
  Bottom 0.3: R26.2 R25.1 9,13.8 9.62,14.43 IC2.2
N$22
  Route15 0.3: 51.6,8.9 56.4,8.9 56.4,7.1 51.6,7.1 51.6,8.9
N$23
  Top 0.3: IC5.5 R22.1
N$24
  Top 0.3: IC4.5 R21.1
N$25  (via drill 0.3)
  Top 0.6: v25.9,8.6 26.5,8 L1.P1
  Bottom 0.3: R37.1 24.1,9.4 C27.2
  Bottom 0.6: C27.2 25.05,9.45 v25.9,8.6 | v25.9,8.6 v26.9,8.6 | v25.9,8.6 v25.9,7.6
N$26
  Bottom 0.3: 56.5,17 57.1,17
N$27
  Top 0.3: IC6.32 33.8,14.85 R46.1
N$28
  Bottom 0.3: IC3.7 51.1,25.9 50.9,25.7 50.9,24.45 C37.2 R39.1
N$29
  Bottom 0.3: Q1.2 C30.2 | C31.1 R34.1
  Bottom 0.6: C30.2 C31.1
N$30
  Top 0.3: RES1.3 36.9,11.1 35.65,12.35 IC6.2
N$31
  Top 0.3: IC6.1 35.15,12.35 33.9,11.1 RES1.1 33.9,8.1
N$32
  Bottom 0.3: C22.2 R27.2 6.7,13.15 6.7,13.9 7.1,14.3 8.6,14.3 8.97,14.68 IC2.3
N$33
  Top 0.3: IC6.26 33.65,17.85 32.9,18.6 30.6,18.6 30.1,19.1 R47.1
N$34
  Top 0.3: IC6.25 34.15,18.35 32.85,19.65 R48.1
N$35
  Top 0.3: IC6.7 38.15,12.8 R50.2
N$36
  Top 0.3: 37.9,26.1 IC10.2 | 37.9,26.1 34.45,26.1 R64.1 PT1.1 R51.1 C55.1 | IC6.18 38.15,19.55 37.9,19.8 37.9,26.1
N$37
  Bottom 0.3: 57.1,25.9 56.6,25.9
N$38
  Bottom 0.3: 51.5,17 IC7.7 53.2,17 53.6,17.4 53.6,20 | 53.6,20 53.6,21.3 R38.1 | 53.6,20 C35.2
N$39
  Top 0.3: IC6.23 35.65,21.05 35.4,21.3 34.9,21.3 34.6,21.6 PT1.2
N$40
  Bottom 0.3: C30.1 24.1,5.4 | C30.1 Q1.1 | R35.2 22.7,5.4 R36.1 C30.1
  Bottom 0.6: 24.1,5.4 C27.1
N$49
  Top 0.3: IC6.24 35.15,20.35 34.9,20.6 33.9,20.6 32.9,21.6 R51.2
N$56
  Top 0.3: R58.1 IC11.5
N$57
  Top 0.3: C56.1 41.4,22 Q2.2 41.5,22.1 41.65,22.1 R52.2 41.6,20 41.6,19.1 40.85,18.35 IC6.16
N$60
  Top 0.3: C57.1 43.8,21.9 Q2.1 43.7,22.1 43.55,22.1 R52.1 43.6,20.1 43.6,18.6 42.85,17.85 IC6.15
N$61
  Top 0.3: C58.2 11.75,21.9 R54.1 12.85,20.9 14,20.9 14.45,20.45 IC4.3 15.99,19.26 R53.2
N$62
  Top 0.3: C59.2 11.75,12.9 R56.1 12.85,13.9 14.3,13.9 14.85,14.45 IC5.3 15.99,13.26 R55.2
N$63
  Top 0.3: C60.2 11.75,6.9 R63.1 12.85,7.9 14.3,7.9 14.85,8.45 IC11.3 15.99,7.26 R62.2
N$64
  Top 0.3: IC6.17 38.65,22.85 40.4,24.6 40.4,27.6 39.9,28.1 36.4,28.1 | 36.4,28.1 34.4,28.1 R64.2 | IC10.4 36.4,27.05 36.4,28.1
OSC
  Bottom 0.3: R37.2 16.85,5.4 7.4,5.4 5.7,7.1 5.05,7.1 C34.1 5.1,7.4 C22.1
PN  (via drill 0.3)
  Top 0.3: v13.95,31.15 C24.2 17.35,31.15 B3.2
  Bottom 0.3: C25.1 12.9,21.6 R32.2 11.85,21.6 11.85,28.7 11.65,28.9 10.3,28.9 10.1,29.1 10.1,29.4 10.3,29.6 11.65,29.6 11.85,29.8 11.85,30.1 11.65,30.3 10.3,30.3 10.1,30.5 10.1,30.8 10.45,31.15 v13.95,31.15
PP  (via drill 0.3)
  Top 0.3: v14,29.25 C24.1 17.35,29.25 B2.2
  Bottom 0.3: R31.2 C23.2 13.55,13.15 14,13.6 14,13.75 v14,29.25
PRI_N
  Top 0.3: B3.1 20.6,31.3 20.8,31.5 21.1,31.5 21.3,31.3 21.3,30.65 21.5,30.45 21.8,30.45 22,30.65 22,31.3 22.2,31.5 22.5,31.5 22.9,31.1 30.1,31.1 30.5,31.5 J1.3
PRI_P
  Top 0.3: B2.1 21.8,29.2 22.9,30.3 30.5,30.3 31.5,31.3 J1.2
RSTN
  Top 0.3: IC6.13 42.7,16.85 R49.2 45.65,14 47.4,14 47.9,14.5 47.9,18.2 51.33,21.62 X1.8
S1
  Top 0.3: B4.1 10.3,35.5 5.1,30.3 1.8,30.3 0.6,29.1 0.6,7.5 0.85,7.25 R10.1
S2
  Top 0.3: R8.1 1.5,28.6 2.3,29.4 11.65,29.4 11.85,29.6 11.85,29.9 11.65,30.1 7,30.1 6.8,30.3 6.8,30.6 7,30.8 11.65,30.8 11.85,31 11.85,31.3 11.65,31.5 8.4,31.5 8.2,31.7 8.2,32 8.4,32.2 11.65,32.2 11.85,32.4 11.85,32.7 11.65,32.9 9.8,32.9 9.6,33.1 9.6,33.4 9.8,33.6 17.3,33.6 17.3,33.4 B5.1
SCK
  Top 0.3: IC6.10 40.85,15.35 44,12.2 48.3,12.2 49.7,13.6 49.7,16.3 51.27,17.88 X1.5
SEK1
  Top 0.3: B4.2 20.6,35.5 21.4,36.3 25.8,36.3 28.5,33.6 J1.5
SEK2
  Top 0.3: B5.2 20.3,33.4 20.8,33.9 21.1,33.9 21.3,33.7 21.3,33 21.5,32.8 21.8,32.8 22,33 22,33.7 22.2,33.9 22.5,33.9 22.7,33.7 22.7,33 22.9,32.8 23.2,32.8 23.4,33 23.4,33.7 23.6,33.9 25.6,33.9 26.5,33 J1.7
SSN
  Top 0.3: IC6.9 40.45,14.85 43.7,11.6 48.6,11.6 50.3,13.3 50.3,15.6 51.33,16.62 X1.4
START
  Top 0.3: IC6.31 33.45,15.35 32.4,14.3 26.8,14.3 25.9,13.4 R43.2 24.3,13.4 JMP1.3 23.7,13 23.7,11.4 21.75,9.45 R58.2
STARTA  (via drill 0.3)
  Top 0.3: C60.1 v8.1,6.9
  Bottom 0.3: R33.1 10.3,9.1 v8.1,6.9
STOP1
  Top 0.3: IC6.30 33.15,15.85 32.4,15.1 26.8,15.1 25.9,16 | 25.9,16 R44.2 | 25.9,16 24.3,16 JMP1.1
STOP1A
  Top 0.3: R6.2 C6.1 9.35,12.95 C59.1
STOP2
  Top 0.3: IC6.27 33.15,17.35 32.4,18.1 26.8,18.1 25.9,19 | 25.9,19 R59.1 | 25.9,19 23.9,19 23.7,19.2 23.7,21.2 23.5,21.4 R21.2
STOP2A
  Top 0.3: R3.2 C3.1 9.35,21.85 C58.1
VCC  (via drill 0.3)
  Top 0.6: v47.2,29.6 R29.1
  Bottom 0.3: 51.5,26.9 IC3.9 IC3.10 C36.1 | 49.3,27.4 47.9,26 47.9,20.9 48.8,20 C35.1 R38.2
  Bottom 0.6: C36.1 49.3,27.4 47.2,29.5 v47.2,29.6 R29.1
VCCIO  (via drill 0.3)
  Top 0.3: 36.15,23.6 IC6.22 | 36.15,23.6 36.15,24.7 IC10.5 | 31.4,23.6 R48.2 R47.2 | IC6.3 36.15,13.35 v36.9,12.6 | 31.4,23.6 36.15,23.6 | 31.4,23.6 C48.1 | 47,16.1 R49.1 | 32.35,10.1 C70.1 R46.2 32.3,11.7 33,11.7 v33.9,12.6
  Top 0.4: v36.9,12.6 36.9,12.1 37.4,11.6 39.85,11.6 C69.1 v39.9,12.6
  Top 0.6: v45.9,22.9 45.9,25.9 45.1,26.7 42.8,26.7 40.4,29.1 v39.4,29.1 33.2,29.1 31.4,27.3 31.4,23.6 | 47,16.1 C28.1 47,15.4 46.5,14.9 v46,14.9
  Bottom 0.3: v33.9,12.6 v36.9,12.6 | v39.9,12.6 43.7,12.6 v46,14.9 45.9,14.9 v45.9,22.9
  Bottom 0.6: R29.2 43.95,29.6 C51.1 43.95,31.95 41.5,34.4 C47.+ 39.4,34.4 v39.4,29.1
VDD
  Top 0.6: B1.2 49.3,22.9 52.5,22.9 X1.9 X1.10
VIN_FILT  (via drill 0.3)
  Top 0.3: R23.2 51.3,29.4 49.3,29.4 D1.C
  Top 0.6: D1.C 49.8,29.9 49.8,31.8 | 49.8,31.8 C39.1 | v50.9,31.8 49.8,31.8
  Bottom 0.3: IC7.2 IC7.1 | IC7.3 IC7.2 | 51.5,16.5 IC7.6 54.3,16.5 55.3,17.5 IC7.3 | IC7.1 57.1,18.5 | IC7.2 57.1,18 | IC7.3 57.1,17.5 | 57.1,27.4 IC3.1 IC3.2 | IC3.2 57.1,26.9 | IC3.3 57.1,26.4 | IC3.3 IC3.2 | 51.5,25.4 IC3.6 54.3,25.4 54.3,25.5 | 54.3,26.4 IC3.3 | IC7.1 56.2,19.9
  Bottom 0.6: v50.9,31.8 54.3,28.4 54.3,26.4 54.3,25.5 56.2,23.6 56.2,19.9 56.15,19.95 C40.1
(copper drawn outside any net)
  shapes: Bottom area x8, Route15 area x4, Route2 area x4, Top circle x1

### Text on the board
Top: 1 | V.Kible | 01/2018 | Rev01
Route2: 2
Route15: 3
Bottom: 4
tDocu: Kunststoff-Unterlags-Scheibe